# EAGLE design Ele1 (EAGLE 9.6.2)
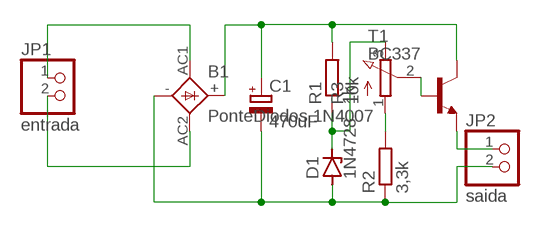
[diagram p0: schematic, sheet 1]

## Parts
B1  PonteDiodos 1N4007  1KAB  [1KAB]
C1  470uF  CPOL-EUE5-10.5  [E5-10,5]
D1  1N4728  [DO41Z10]
JP1  entrada  PINHD-1X2  [1X02]
JP2  saida  PINHD-1X2  [1X02]
R1  1k  R-EU_0204/7  [0204/7]
R2  3,3k  R-EU_0204/7  [0204/7]
R3  10k  3RP/1610N  [3RP/1610N]
T1  BC337  2N3904  [TO92]

## Nets
N$1: B1.AC1 JP1.1
N$2: B1.AC2 JP1.2
N$3: B1.+ C1.+ R1.2 T1.1(C)
N$4: JP2.1 T1.3(E)
N$5: R2.2 R3.1(A)
N$6: B1.- C1.- D1.A JP2.2 R2.1
N$7: D1.C R1.1 R3.3(E)
N$9: R3.2(S) T1.2(B)

## Library data of the parts
B1 = rectifier:1KAB: RECTIFIER grid 5,08 x 5,08 mm
C1 = rcl:CPOL-EU: POLARIZED CAPACITOR, European symbol; SPICEPREFIX: C
D1 = diode:1N4728: Z DIODE 3.3 V, 1W, 5 percent
JP1 JP2 = pinhead:PINHD-1X2: PIN HEADER
R1 R2 = rcl:R-EU_: RESISTOR, European symbol; SPICEPREFIX: R
R3 = pot:3RP/1610N: 16mm Potentiometer one level Source: http://www.alphapotentiometers.net/html/16mm_pot_2.html
T1 = transistor:2N3904: NPN TRANSISTOR

## Board
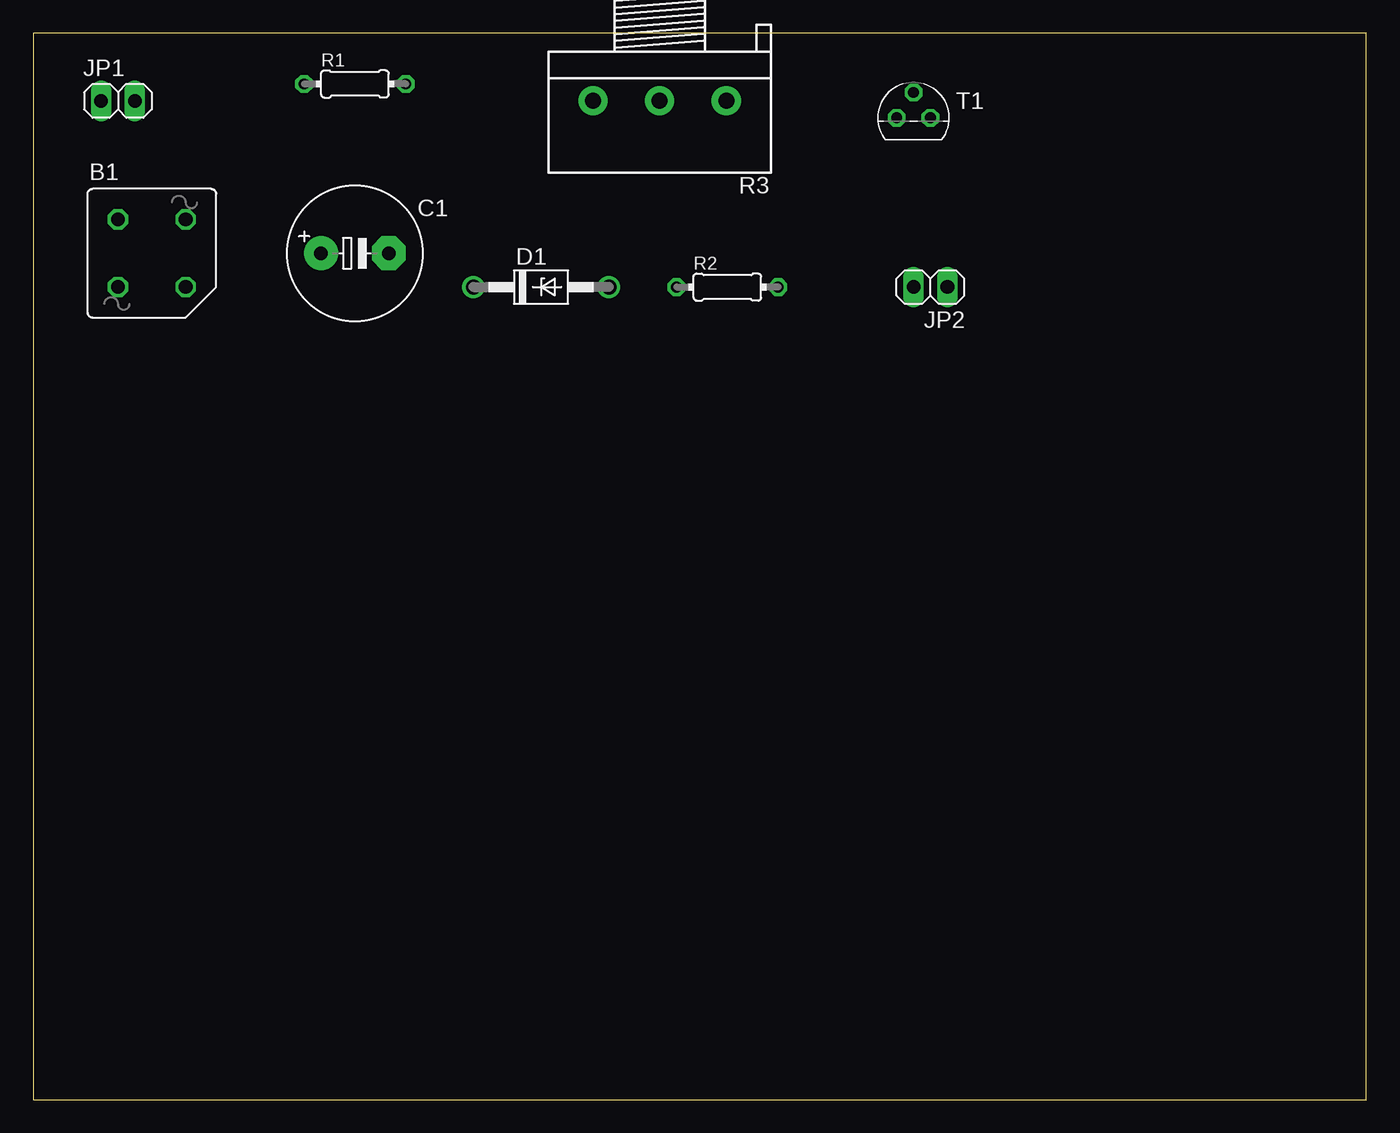
[diagram p1: board, top side]
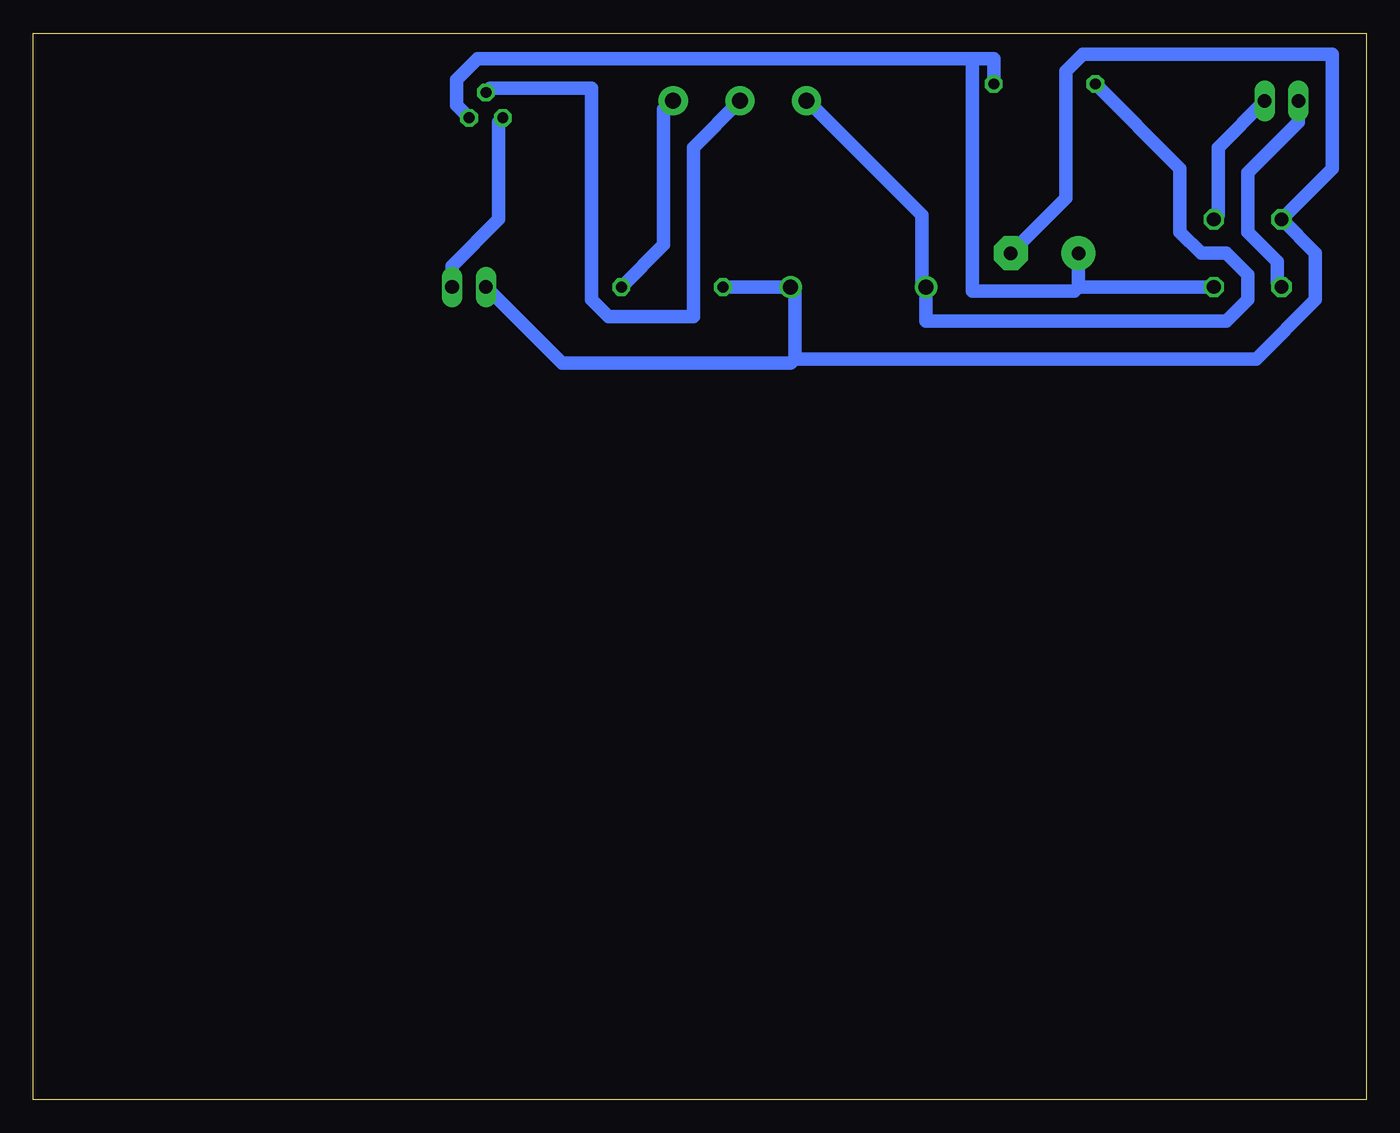
[diagram p2: board, bottom side, seen from below]

Size 100 x 80 mm. Coordinates in mm from the lower left corner, seen from the top.
Outline: 0,0 100,0 100,80 0,80 0,0
Copper layers (1*16): Top 0.035mm / dielectric 1.5mm / Bottom 0.035mm
Design rules "default *": minimum track width 40mil, minimum drill 0.35mm, track to track 40mil, track to pad 40mil, pad to pad 40mil, via to via 40mil, smd to smd 6mil, copper to edge 40mil, drill to drill 6mil, minimum pad ring 10mil, minimum via ring 8mil, stop-mask expansion 4mil, vias tented up to drill 0mil, thermal gap 10mil

### Footprints (pad centres in the part's own frame; a part is rotated, then mirrored left to right if it is on the bottom)
1KAB = drill 1.016 octagon: + 2.54,-2.54; - -2.54,2.54; AC1 -2.54,-2.54; AC2 2.54,2.54
E5-10,5 = drill 1.016 pad 2.54: + -2.54,0 | drill 1.016 pad 2.54 octagon: - 2.54,0
DO41Z10 = drill 1.118: A 5.08,0; C -5.08,0
1X02 = drill 1.016 long: 1 -1.27,0; 2 1.27,0
0204/7 = drill 0.813 octagon: 1 -3.81,0; 2 3.81,0
3RP/1610N = drill 1.2 pad 2.184: 1 -5,0; 2 0,0; 3 5,0
TO92 = drill 0.813 octagon: 1 1.27,0; 2 0,1.905; 3 -1.27,0

### Placement (x,y rotation side)
B1  8.89,63.5 0 top
C1  24.13,63.5 0 top
D1  38.1,60.96 0 top
JP1  6.35,74.93 0 top
JP2  67.31,60.96 180 top
R1  24.13,76.2 0 top
R2  52.07,60.96 0 top
R3  46.99,74.93 180 top
T1  66.04,73.66 0 top

### Tracks (layer width: path | path; a pad name or v marks a point on that pad's centre or on a via)
N$1
  Bottom 1.016: B1.AC1 6.67,61.28 6.67,62.87 8.89,65.09 8.89,69.53 5.08,73.34 JP1.1
N$2
  Bottom 1.016: B1.AC2 11.11,66.36 11.11,71.44 JP1.2
N$3
  Bottom 1.016: 21.59,60.96 B1.+ | C1.+ 21.59,60.96 | T1.1 68.26,74.61 68.26,76.52 66.67,78.11 29.53,78.11 | 29.53,78.11 27.94,78.11 R1.2 | 29.53,78.11 29.53,60.64 21.91,60.64 21.59,60.96
N$4
  Bottom 1.016: T1.3 65.09,73.34 65.09,66.04 68.58,62.55 JP2.1
N$5
  Bottom 1.016: R2.2 52.7,64.14 52.7,74.3 52.07,74.93 R3.1
N$6
  Bottom 1.016: R2.1 D1.A 42.86,60.64 42.86,55.56 | 42.86,55.56 8.26,55.56 3.81,60.01 3.81,63.5 B1.- 2.54,69.85 2.54,78.42 21.27,78.42 22.54,77.15 22.54,67.63 C1.- | JP2.2 60.33,55.24 43.18,55.24 42.86,55.56
N$7
  Bottom 1.016: R1.1 13.97,69.85 13.97,65.09 12.38,63.5 10.48,63.5 8.89,61.91 8.89,60.01 10.48,58.42 33.02,58.42 D1.C 33.34,61.28 33.34,66.36 41.91,74.93 R3.3
N$9
  Bottom 1.016: T1.2 65.72,75.88 58.1,75.88 58.1,60.01 56.83,58.74 50.48,58.74 50.48,71.44 R3.2